# EAGLE schematic SparkFun_TLC5940_Breakout (EAGLE 6.4)
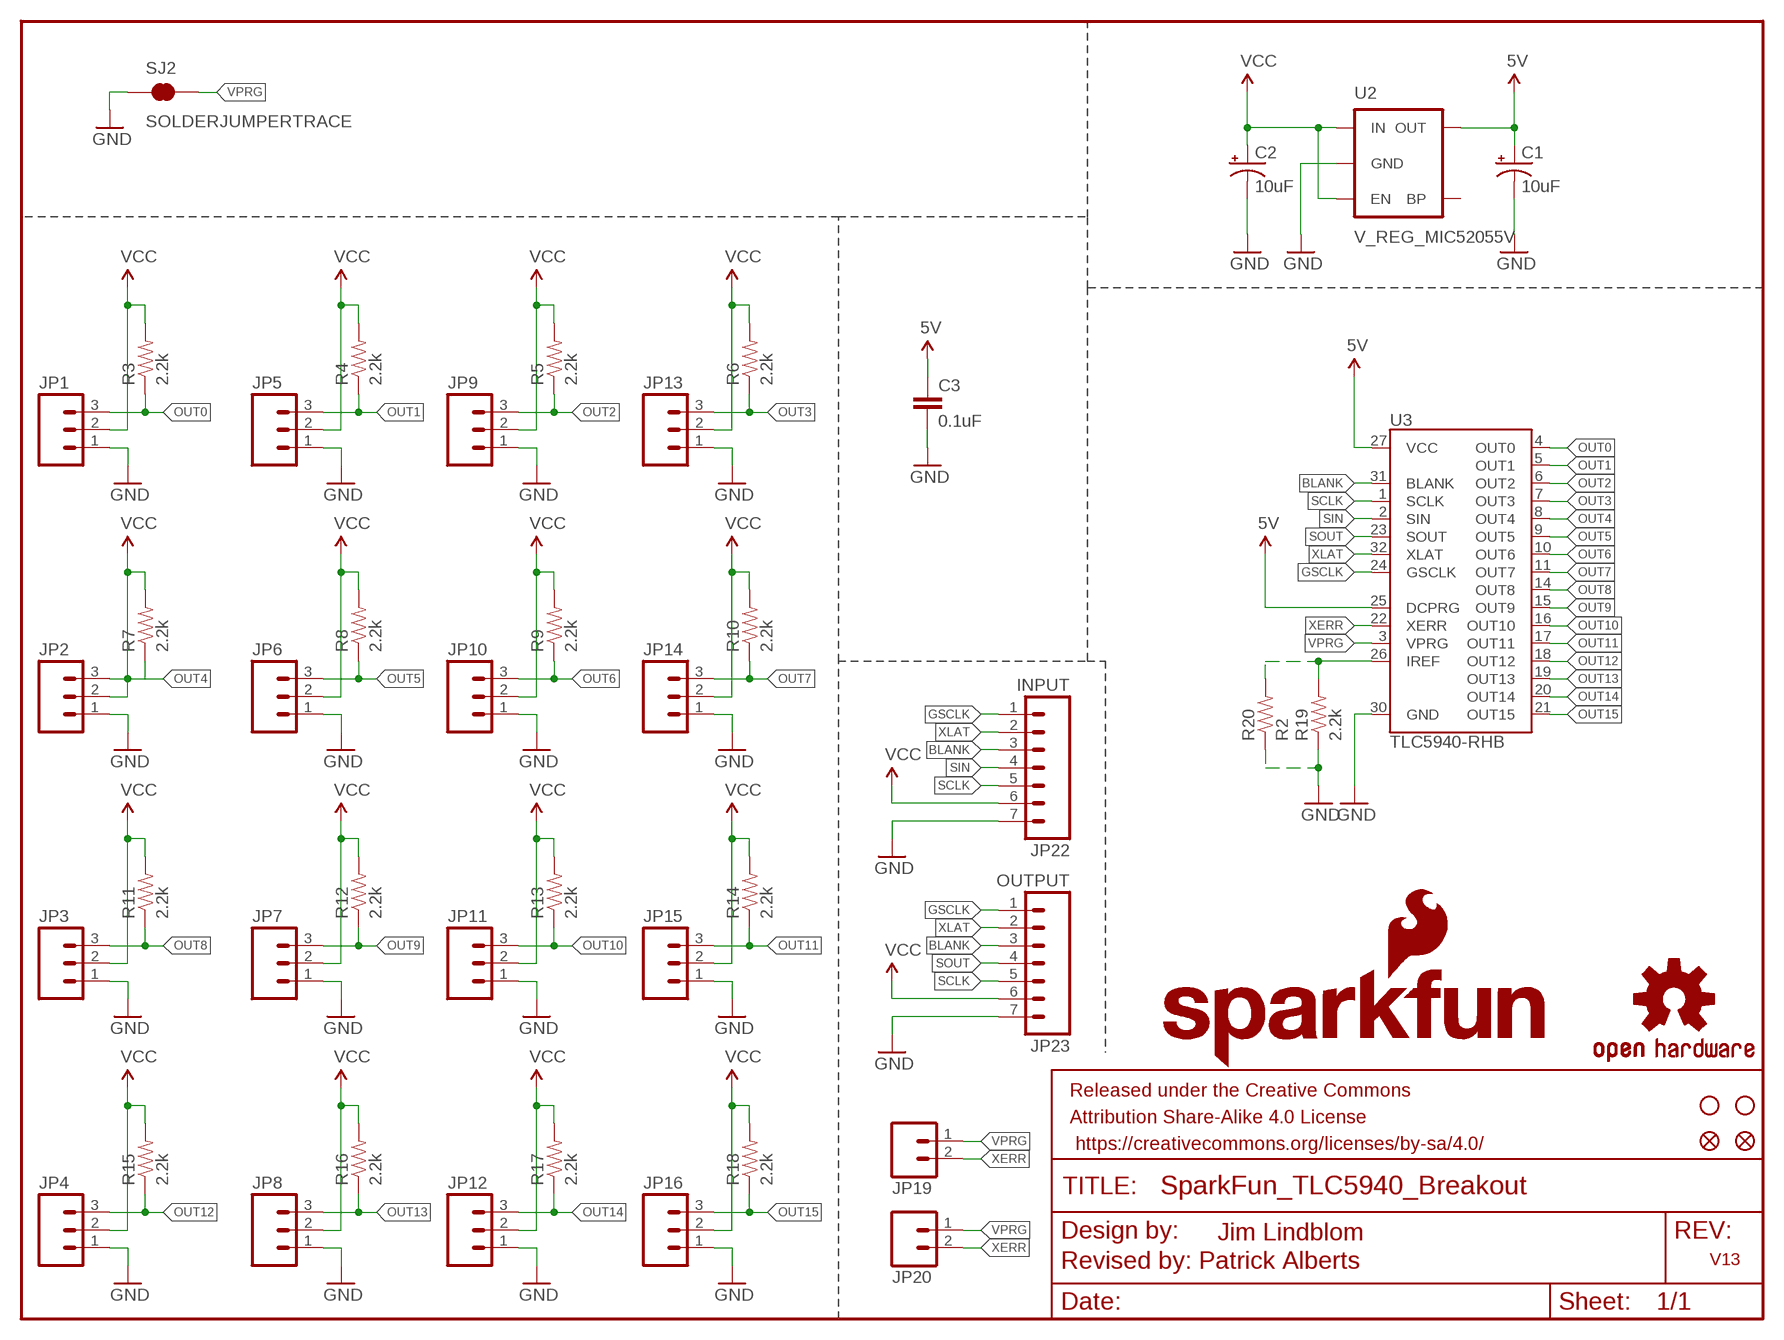
[diagram p0: schematic, sheet 1]

## Parts
C1  10uF  10UF-16V-10%(TANT)  [EIA3216]
C2  10uF  10UF-20V-10%(TANT)  [EIA3528]
C3  0.1uF  0.1UF-25V(+80/-20%)(0603)  [0603-CAP]
FRAME1  FRAME-LETTER  [CREATIVE_COMMONS]
JP1  M03PTH  [1X03]
JP2  M03PTH  [1X03]
JP3  M03PTH  [1X03]
JP4  M03PTH  [1X03]
JP5  M03PTH  [1X03]
JP6  M03PTH  [1X03]
JP7  M03PTH  [1X03]
JP8  M03PTH  [1X03]
JP9  M03PTH  [1X03]
JP10  M03PTH  [1X03]
JP11  M03PTH  [1X03]
JP12  M03PTH  [1X03]
JP13  M03PTH  [1X03]
JP14  M03PTH  [1X03]
JP15  M03PTH  [1X03]
JP16  M03PTH  [1X03]
JP17  STAND-OFF  [STAND-OFF]
JP18  STAND-OFF  [STAND-OFF]
JP19  M02PTH  [1X02]
JP20  M02PTH  [1X02]
JP21  FIDUCIAL1X2  [FIDUCIAL-1X2]
JP22  INPUT  M07  [1X07]
JP23  OUTPUT  M07  [1X07]
JP26  FIDUCIAL1X2  [FIDUCIAL-1X2]
LOGO1  OSHW-LOGOS  [OSHW-LOGO-S]
LOGO2  SFE_LOGO_NAME_FLAME.2_INCH  [SFE_LOGO_NAME_FLAME_.2]
R3  2.2k  2.2KOHM-1/10W-1%(0603)  [0603-RES]
R4  2.2k  2.2KOHM-1/10W-1%(0603)  [0603-RES]
R5  2.2k  2.2KOHM-1/10W-1%(0603)  [0603-RES]
R6  2.2k  2.2KOHM-1/10W-1%(0603)  [0603-RES]
R7  2.2k  2.2KOHM-1/10W-1%(0603)  [0603-RES]
R8  2.2k  2.2KOHM-1/10W-1%(0603)  [0603-RES]
R9  2.2k  2.2KOHM-1/10W-1%(0603)  [0603-RES]
R10  2.2k  2.2KOHM-1/10W-1%(0603)  [0603-RES]
R11  2.2k  2.2KOHM-1/10W-1%(0603)  [0603-RES]
R12  2.2k  2.2KOHM-1/10W-1%(0603)  [0603-RES]
R13  2.2k  2.2KOHM-1/10W-1%(0603)  [0603-RES]
R14  2.2k  2.2KOHM-1/10W-1%(0603)  [0603-RES]
R15  2.2k  2.2KOHM-1/10W-1%(0603)  [0603-RES]
R16  2.2k  2.2KOHM-1/10W-1%(0603)  [0603-RES]
R17  2.2k  2.2KOHM-1/10W-1%(0603)  [0603-RES]
R18  2.2k  2.2KOHM-1/10W-1%(0603)  [0603-RES]
R19  2.2k  2.2KOHM-1/10W-1%(0603)  [0603-RES]
R20  R2  RESISTORKIT  [AXIAL-0.3-KIT]
SJ2  SOLDERJUMPERTRACE  [SJ_2S-TRACE]
U2  V_REG_MIC52055V  [SOT23-5]
U3  TLC5940-RHB  [QFN-32]

## Nets
5V: C1.A(+) C3.1 U2.5(OUT) U3.25(DCPRG) U3.27(VCC)
BLANK: JP22.3 JP23.3 U3.31(BLANK)
GND: C1.C(-) C2.C(-) C3.2 JP1.1 JP2.1 JP3.1 JP4.1 JP5.1 JP6.1 JP7.1 JP8.1 JP9.1 JP10.1 JP11.1 JP12.1 JP13.1 JP14.1 JP15.1 JP16.1 JP22.7 JP23.7 R19.1 R20.P$1 SJ2.1 U2.2(GND) U3.30(GND)
GSCLK: JP22.1 JP23.1 U3.24(GSCLK)
N$1: R19.2 R20.P$2 U3.26(IREF)
OUT0: JP1.3 R3.1 U3.4(OUT0)
OUT1: JP5.3 R4.1 U3.5(OUT1)
OUT2: JP9.3 R5.1 U3.6(OUT2)
OUT3: JP13.3 R6.1 U3.7(OUT3)
OUT4: JP2.3 R7.1 U3.8(OUT4)
OUT5: JP6.3 R8.1 U3.9(OUT5)
OUT6: JP10.3 R9.1 U3.10(OUT6)
OUT7: JP14.3 R10.1 U3.11(OUT7)
OUT8: JP3.3 R11.1 U3.14(OUT8)
OUT9: JP7.3 R12.1 U3.15(OUT9)
OUT10: JP11.3 R13.1 U3.16(OUT10)
OUT11: JP15.3 R14.1 U3.17(OUT11)
OUT12: JP4.3 R15.1 U3.18(OUT12)
OUT13: JP8.3 R16.1 U3.19(OUT13)
OUT14: JP12.3 R17.1 U3.20(OUT14)
OUT15: JP16.3 R18.1 U3.21(OUT15)
SCLK: JP22.5 JP23.5 U3.1(SCLK)
SIN: JP22.4 U3.2(SIN)
SOUT: JP23.4 U3.23(SOUT)
VCC: C2.A(+) JP1.2 JP2.2 JP3.2 JP4.2 JP5.2 JP6.2 JP7.2 JP8.2 JP9.2 JP10.2 JP11.2 JP12.2 JP13.2 JP14.2 JP15.2 JP16.2 JP22.6 JP23.6 R3.2 R4.2 R5.2 R6.2 R7.2 R8.2 R9.2 R10.2 R11.2 R12.2 R13.2 R14.2 R15.2 R16.2 R17.2 R18.2 U2.1(IN) U2.3(EN)
VPRG: JP19.1 JP20.1 SJ2.2 U3.3(VPRG)
XERR: JP19.2 JP20.2 U3.22(XERR)
XLAT: JP22.2 JP23.2 U3.32(XLAT)
Unconnected: U2.4(BP)

## Notes on the sheet
- Jim Lindblom
- Revised by: Patrick Alberts | V13

## Library data of the parts
C1 = SparkFun-Capacitors:10UF-16V-10%(TANT): CAP-00811 1206/EIA-3216 Tantalum capacitor; PROD_ID: CAP-00811
C2 = SparkFun-Capacitors:10UF-20V-10%(TANT): CAP-08063; PROD_ID: CAP-08063
C3 = SparkFun-Capacitors:0.1UF-25V(+80/-20%)(0603): CAP-00810 Ceramic Standard decoupling cap; PROD_ID: CAP-00810
FRAME1 = SparkFun-Aesthetics:FRAME-LETTER: Schematic Frame Standard 8.5x11 US Letter frame
JP1-JP16 = SparkFun:M03: Header 3 Standard 3-pin 0.1" header. Use with straight break away headers (SKU : PRT-00116), right angle break away headers (PRT-00553), swiss pins (PRT-00743), machine pins (PRT-00117), and female headers (PRT-00115). Molex polarized connector foot print use with SKU : PRT-08232 with associated crimp pins and housings.
JP17 JP18 = SparkFun:STAND-OFF: Stand Off This is the mechanical footprint for a #4 phillips button head screw. Use the keepout ring to avoid running the screw head into surrounding components. SKU : PRT-00447
JP19 JP20 = SparkFun:M02: Header 2 Standard 2-pin 0.1" header. Use with straight break away headers (SKU : PRT-00116), right angle break away headers (PRT-00553), swiss pins (PRT-00743), machine pins (PRT-00117), and female headers (PRT-00115). Molex polarized connector foot print use with SKU : PRT-08233 with associated crimp pins and housings.
JP21 JP26 = SparkFun:FIDUCIAL: Fiducial Alignment Points Various fiducial points for machine vision alignment.
JP22 JP23 = SparkFun:M07: Header 7 Standard 7-pin 0.1" header. Use with straight break away headers (SKU : PRT-00116), right angle break away headers (PRT-00553), swiss pins (PRT-00743), machine pins (PRT-00117), and female headers (PRT-00115). NOTES ON THE VARIANTS LOCK and LOCK_LONGPADS... This footprint was designed to help hold the alignment of a through-hole component (i.e. 7-pin header) while soldering it into place. You may notice that each hole has been shifted either up or down by 0.005 of an inch from it's more standard position (which is usually a perfectly straight line). This slight alteration caused the pins (the squares in the middle) to touch the edges of the holes. Because they are alternating, it causes a "brace" to hold the header in place. 0.005 has proven to be the perfect amount of "off-center" position when using our standard breakaway headers. Although looks a little odd when you look at the bare footprint, once you have a header in there, the alteration is very hard to notice. Also, if you push a header all the way into place, it is covered up entirely on the bottom side. This idea of altering the position of holes to aid alignment will be further integrated into the Sparkfun Library for other footprints. It can help hold any component with 3 or more connection pins.
LOGO1 = SparkFun-Aesthetics:OSHW-LOGO: Open Source Hardware Logo This logo indicates the piece of hardware it is found on incorporates a OSHW license and/or adheres to the definition of open source hardware found here: http://freedomdefined.org/OSHW
LOGO2 = SparkFun-Aesthetics:SFE_LOGO_NAME_FLAME: SFE Logo, name and flame This is the SparkFun full logo. The logo on the schematic will always be the same size; the package variant is the height of the flame part of the logo. Default layer for the logo on the board is tSilk.
R3-R19 = SparkFun-Resistors:2.2KOHM-1/10W-1%(0603): RES-08272; PROD_ID: RES-08272
R20 = SparkFun-Resistors:RESISTOR: Resistor Basic schematic elements and footprints for 0603, 1206, and PTH resistors.
SJ2 = SparkFun:SOLDERJUMPER: Solder Jumper Standard SMD solder jumper. Used to automate production. Two varients : Normally Open and Normally Closed are the same, but have different paste layers. NC will have a large amount of paste and should jumper during reflow.
U2 = SparkFun-PowerIC:V_REG_MIC5205: V_REG MIC5219 Standard 3.3V and 5V 150mA LDO voltage regulator in SOT-23 layout. Micrel part MIC5205. BP (by-pass) pin is used to lower output noise with 470pF cap, may be left open.; PROD_ID: VREG-00823; VALUE: 5V
U3 = SparkFun-DigitalIC:TLC5940: 16-channel LED Driver with Dot Correction and Grayscale PWM Control The TLC5940 is a 16-channel, constant-current sink LED driver. Each channel has an individually adjustable 4096-step grayscale PWM brightness control and a 64-step, constant-current sink (dot correction). The dot correction adjusts the brightness variations between LED channels and other LED drivers. The dot correction data is stored in an integrated EEPROM. Both grayscale control and dot correction are accessible via a serial interface. A single external resistor sets the maximum current value of all 16 channels. Packages: 28-pin HTSSOP 32-pin 5x5mm QFN 28-pin DIP; PROD_ID: IC-10398